# EAGLE design FEP (EAGLE 9.4.2)
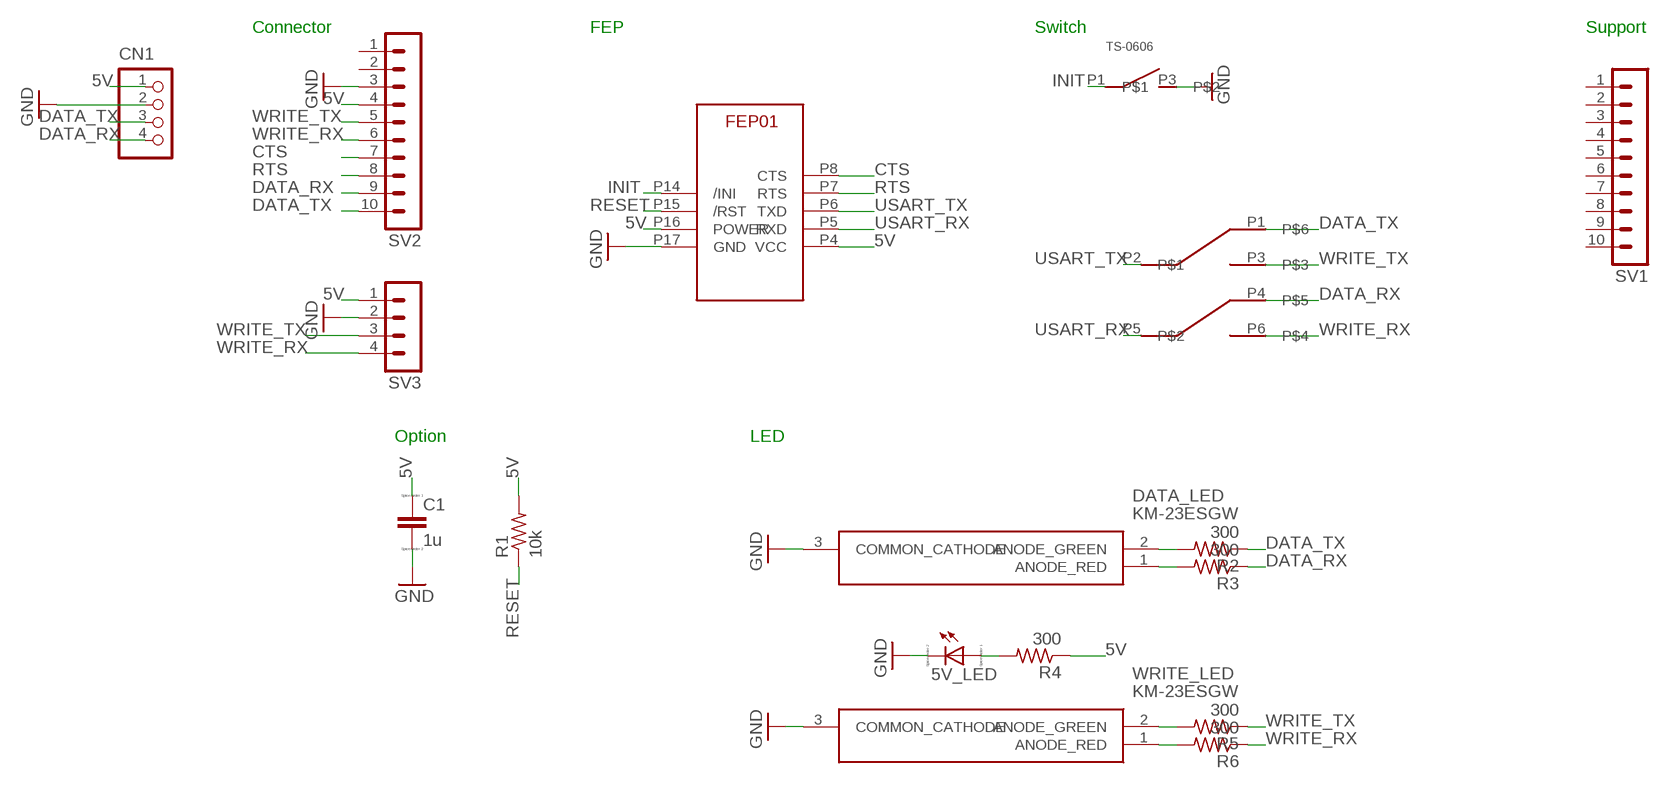
[diagram p0: schematic, sheet 1]

## Parts
5V_LED  LED_E  [LED_1206]
C1  1u  CC0603  [C0603]
CN1  S4B-XASK-1  [S4B-XASK-1]
DATA_LED  KM-23ESGW  [SOT-23]
FEP_1  FEP01  [FEP01]
R1  10k  R-US_R0603  [R0603]
R2  300  R-US_R0603  [R0603]
R3  300  R-US_R0603  [R0603]
R4  300  R-US_R0603  [R0603]
R5  300  R-US_R0603  [R0603]
R6  300  R-US_R0603  [R0603]
SV1  MA10-1  [MA10-1]
SV2  MA10-1  [MA10-1]
SV3  MA04-1  [MA04-1]
SW_1  P-03647_TS-0606  [TS-0606]
SW_3  P-08784_PS-70S  [PS-70S]
WRITE_LED  KM-23ESGW  [SOT-23]

## Nets
5V: C1.1 CN1.1 FEP_1.P4(VCC) FEP_1.P16(POWER) R1.2 R4.1 SV2.4 SV3.1
CTS: FEP_1.P8(CTS) SV2.7
DATA_RX: CN1.4 R3.1 SV2.9 SW_3.P4
DATA_TX: CN1.3 R2.1 SV2.10 SW_3.P1
GND: 5V_LED.C C1.2 CN1.2 DATA_LED.3(COMMON_CATHODE) FEP_1.P17(GND) SV2.3 SV3.2 SW_1.P3 WRITE_LED.3(COMMON_CATHODE)
INIT: FEP_1.P14(/INI) SW_1.P1
N$1: DATA_LED.1(ANODE_RED) R3.2
N$2: DATA_LED.2(ANODE_GREEN) R2.2
N$3: 5V_LED.A R4.2
N$4: R6.2 WRITE_LED.1(ANODE_RED)
N$5: R5.2 WRITE_LED.2(ANODE_GREEN)
RESET: FEP_1.P15(/RST) R1.1
RTS: FEP_1.P7(RTS) SV2.8
USART_RX: FEP_1.P5(RXD) SW_3.P5
USART_TX: FEP_1.P6(TXD) SW_3.P2
WRITE_RX: R6.1 SV2.6 SV3.4 SW_3.P6
WRITE_TX: R5.1 SV2.5 SV3.3 SW_3.P3
Unconnected: SV1.1 SV1.2 SV1.3 SV1.4 SV1.5 SV1.6 SV1.7 SV1.8 SV1.9 SV1.10 SV2.1 SV2.2

## Notes on the sheet
- Connector | FEP | Switch | Support
- Option | LED

## Library data of the parts
5V_LED = eagle-ltspice:LED_E: LED Source: http://www.osram.convergy.de Source: www.luxeon.com Source: www.kingbright.com; SPICEMODEL: NONE; SPICEPREFIX: D; SPICETYPE: diode
C1 = eagle-ltspice:C: CAPACITOR, European symbol; SPICEMODEL: NONE; SPICEPREFIX: C
CN1 = jst-xa:S4B-XASK-1: Wire-to-Board 2.5mm pitch top mount connector Source: http://www.jst-mfg.com/product/pdf/jpn/XA1.pdf http://www.jst-mfg.com/product/detail.php?series=272
DATA_LED WRITE_LED = SamacSys_Parts:KM-23ESGW: KINGBRIGHT - KM-23ESGW - LED, SMD, RED/GRN Source: Datasheet <http://www.farnell.com/datasheets/2047454.pdf>; DESCRIPTION: KINGBRIGHT - KM-23ESGW - LED, SMD, RED/GRN; HEIGHT: mm; MANUFACTURER_NAME: Kingbright; MANUFACTURER_PART_NUMBER: KM-23ESGW; MOUSER_PART_NUMBER: N/A; MOUSER_PRICE-STOCK: https://www.mouser.com/Search/Refine.aspx?Keyword=N%2FA
FEP_1 = Robot Creating Club:FEP01
R1-R6 = audio amplifier example:R-US_: RESISTOR, American symbol
SV1 SV2 = con-lstb:MA10-1: PIN HEADER; OC_FARNELL: unknown; OC_NEWARK: unknown
SV3 = con-lstb:MA04-1: PIN HEADER; OC_FARNELL: unknown; OC_NEWARK: unknown
SW_1 = Akizuki:P-03647_TS-0606
SW_3 = Akizuki:P-08784_PS-70S

## Board
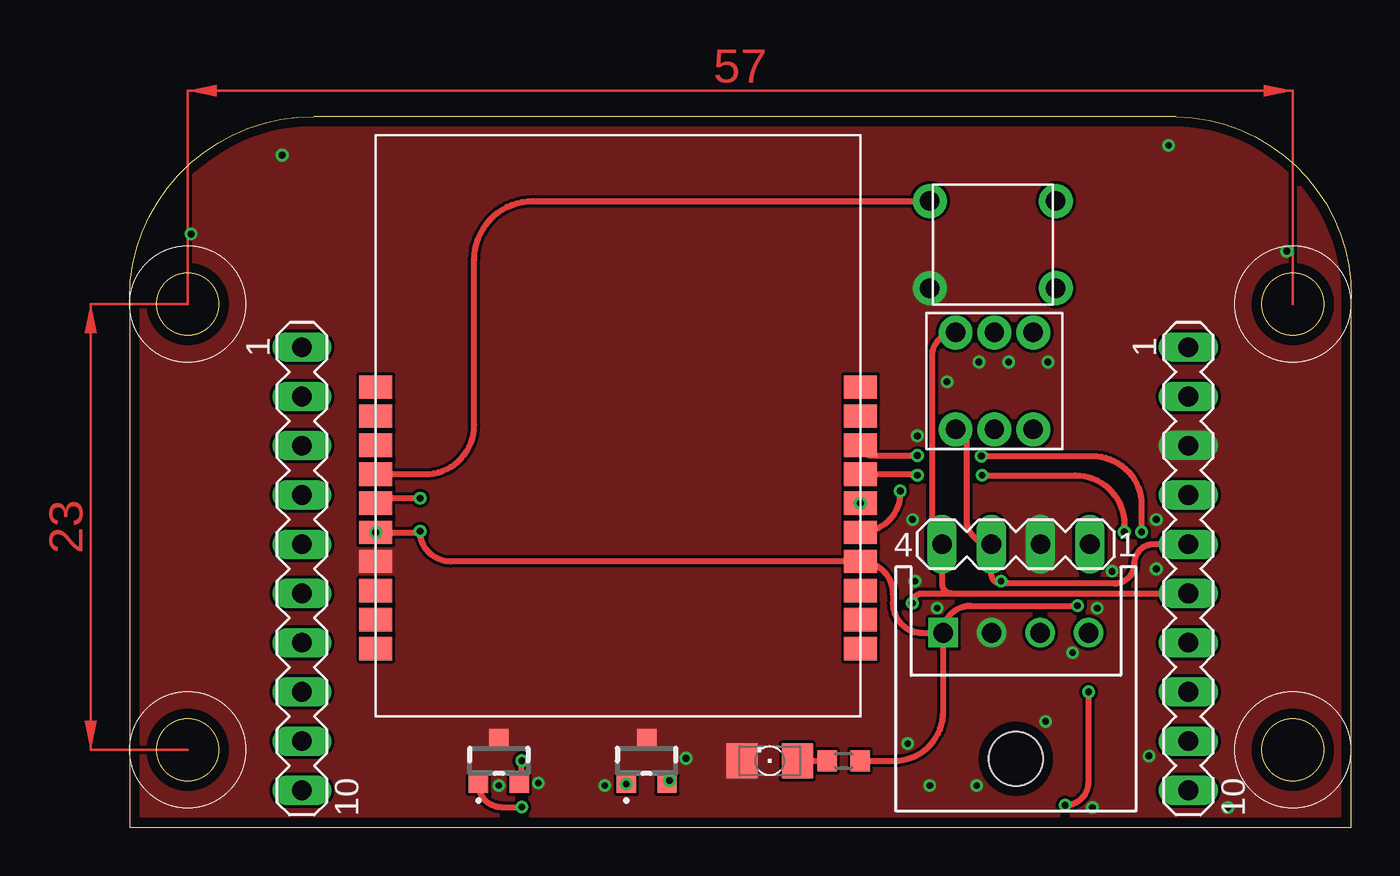
[diagram p1: board, top side]
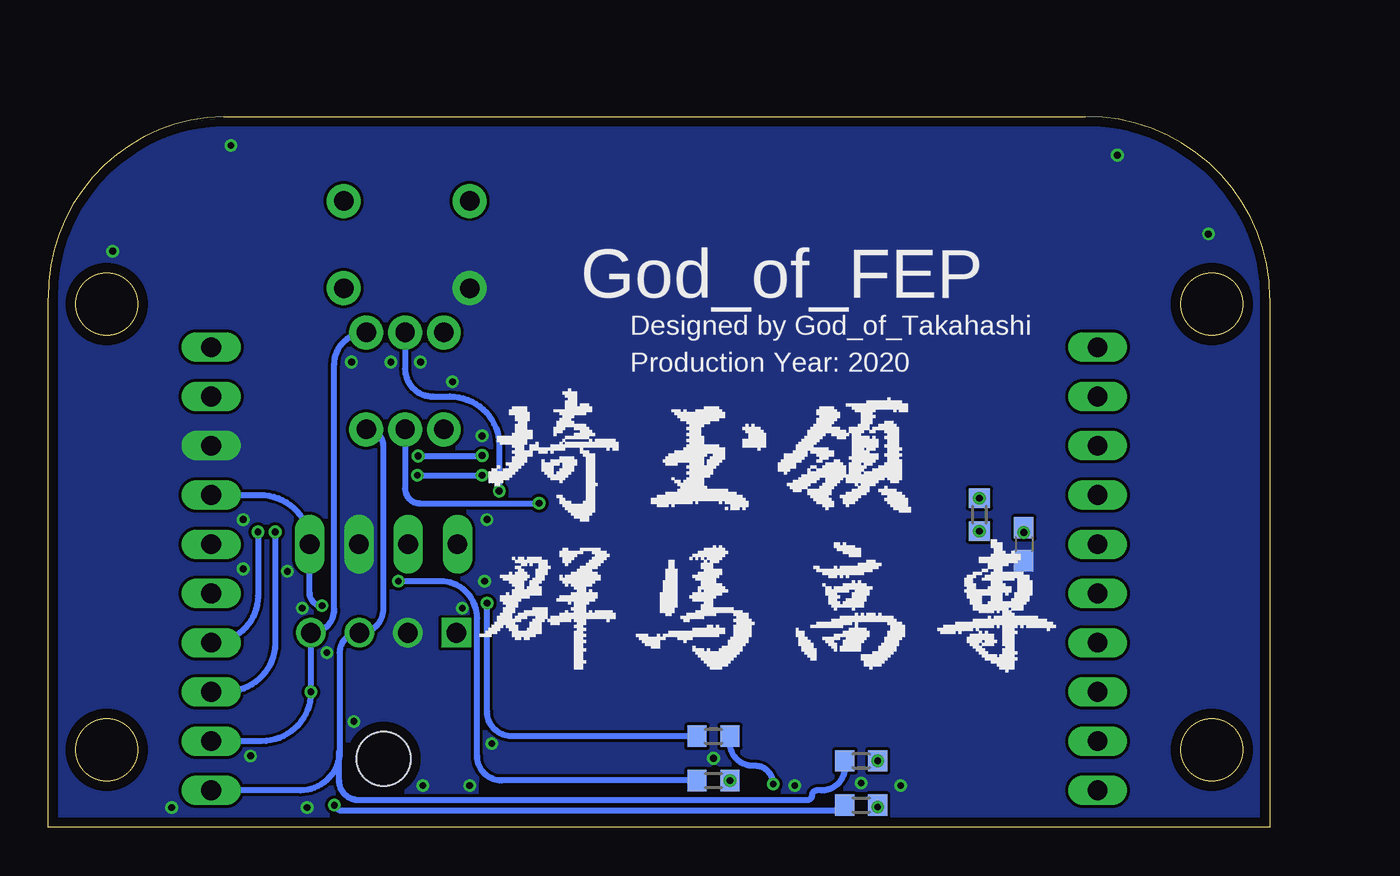
[diagram p2: board, bottom side, seen from below]

Size 63 x 36.66 mm. Coordinates in mm from the lower left corner, seen from the top.
Outline: 0,0 63,0 63,27.3 arc90 53.98,36.66 9.53,36.66 arc90 0,27.3 0,0
Outline: circle at 3,27 radius 1.6
Outline: circle at 3,4 radius 1.6
Outline: circle at 60,4 radius 1.6
Outline: circle at 60,27 radius 1.6
Copper layers (1*16): Top 0.035mm / dielectric 1.6mm / Bottom 0.035mm
Design rules "Elecrow_2-layer_PCB_eagle_rule": minimum track width 6mil, minimum drill 12mil, track to track 6mil, track to pad 6mil, pad to pad 6mil, via to via 8mil, smd to smd 0mil, copper to edge 20mil, drill to drill 10mil, minimum pad ring 6mil, minimum via ring 6mil, stop-mask expansion 0mil, vias tented up to drill 100mil, thermal gap 10mil
bRestrict: 3 lines

### Footprints (pad centres in the part's own frame; a part is rotated, then mirrored left to right if it is on the bottom)
LED_1206 = smd 1.6 x 1.803: A -1.422,0; C 1.422,0
C0603 = smd 1.1 x 1: 1 -0.85,0; 2 0.85,0
S4B-XASK-1 = drill 1.016 square: 1 3.75,0 | drill 1.016: 2 1.25,0; 3 -1.25,0; 4 -3.75,0 | hole 2.8: 0,6.5
SOT-23 = smd 1 x 0.9: 1 1.05,1.2; 2 -1.05,1.2; 3 0,-1.2
FEP01 = smd 1.7 x 1.2: P1 25,3.5; P2 25,5; P3 25,6.5; P4 25,8; P5 25,9.5; P6 25,11; P7 25,12.5; P8 25,14; P9 25,15.5; P10 25,17; P11 0,17; P12 0,15.5; P13 0,14; P14 0,12.5; P15 0,11; P16 0,9.5; P17 0,8; P18 0,6.5; P19 0,5; P20 0,3.5
R0603 = smd 1 x 1.1: 1 -0.85,0; 2 0.85,0
MA10-1 = drill 1.016 long: 1 -11.43,0; 2 -8.89,0; 3 -6.35,0; 4 -3.81,0; 5 -1.27,0; 6 1.27,0; 7 3.81,0; 8 6.35,0; 9 8.89,0; 10 11.43,0
MA04-1 = drill 1.016 long: 1 -3.81,0; 2 -1.27,0; 3 1.27,0; 4 3.81,0
TS-0606 = drill 1 pad 1.75: P1 0,4.5; P2 6.5,4.5; P3 0,0; P4 6.5,0
PS-70S = drill 1 pad 1.75: P1 0,5; P2 2,5; P3 4,5; P4 0,0; P5 2,0; P6 4,0

### Placement (x,y rotation side)
5V_LED  33.02,3.43 180 top
C1  12.7,14.61 270 bottom
CN1  45.72,10.03 180 top
DATA_LED  19.05,3.43 180 top
FEP_1  12.7,5.71 0 top
R1  14.99,16.13 270 bottom
R2  21.08,3.43 0 bottom
R3  21.08,1.14 0 bottom
R4  36.83,3.43 180 top
R5  28.7,2.41 0 bottom
R6  28.7,4.7 0 bottom
SV1  8.89,13.34 270 top
SV2  54.61,13.34 270 top
SV3  45.72,14.61 180 top
SW_1  41.27,27.81 0 top
SW_3  46.61,25.53 180 top
WRITE_LED  26.67,3.43 180 top

### Tracks (layer width: path | path; a pad name or v marks a point on that pad's centre or on a via)
5V  (via drill 0.35)
  Top 0.305: R4.1 39.43,3.43 arc90 41.97,5.97 CN1.1 | FEP_1.P16 14.92,15.21 arc90 R1.2 arc90 16.55,13.71 FEP_1.P4 arc-90 39.37,12.04 39.37,11.56 arc90 40.89,10.03 CN1.1 | CN1.1 arc-90 43.37,11.43 v48.89,11.43
  Bottom 0.305: C1.1 FEP_1.P16 | SV2.4 52.07,17.14 arc90 SV3.1 49.53,12.07 arc-90 v48.89,11.43
  other vias: 14.99,15.28 12.7,15.21
CTS  (via drill 0.35)
  Top 0.305: FEP_1.P8 arc90 38.24,19.18 v40.64,19.18 | v43.94,19.15 49.66,19.15 arc-90 52.2,16.61 v52.2,15.24
  Bottom 0.305: v43.94,19.15 40.66,19.15 arc90 v40.64,19.18 | v52.2,15.24 52.2,11.94 arc90 SV2.7
DATA_RX  (via drill 0.35)
  Top 0.305: v48.26,1.14 arc90 49.47,2.35 v49.47,6.99
  Bottom 0.305: SV2.9 52.01,4.45 arc-90 v49.47,6.99 CN1.4 arc-90 48.26,11.24 48.26,23.88 arc90 SW_3.P4 | v48.26,1.14 48.01,0.89 22.19,0.89 R3.1
DATA_TX
  Bottom 0.305: 47.99,3.94 47.99,9.02 arc90 CN1.3 arc-90 45.72,11.28 45.72,19.64 arc-90 SW_3.P1 | 47.99,3.94 arc90 50.02,1.91 SV2.10 | R2.1 21.93,3.09 arc90 23.11,1.91 23.37,1.91 arc-90 23.62,1.65 arc90 23.88,1.4 46.99,1.4 arc90 48.01,2.41 48.01,3.92 arc90 47.99,3.94
GND  (via drill 0.35)
  other vias: 3.17,30.61 7.87,34.67 53.59,35.18 59.69,29.72 45.34,24 47.37,24 40.64,20.19 52.58,3.68 49.66,1.02 56.64,1.02 43.69,2.16 47.24,5.46 41.66,11.3 41.27,2.16 40.39,15.88 40.51,12.7 40.13,4.32 28.7,3.56 21.08,2.29 24.51,2.16 43.81,24 19.05,2.16 49.91,11.3 48.64,9.02 50.67,13.21 52.96,13.34 52.96,15.88 42.16,22.99
  pour Bottom (no thermals): -4.92,40.01 -4.92,-0.64 68.42,-0.64 68.42,40.01
  pour Top (no thermals): -4.92,40.01 -4.92,-0.64 68.42,-0.64 68.42,40.01
INIT
  Top 0.305: FEP_1.P14 15.24,18.21 arc90 17.78,20.75 17.78,29.27 arc-90 20.83,32.31 SW_1.P1
N$1  (via drill 0.35)
  Top 0.305: DATA_LED.1 arc90 19.18,1.04 v20.23,1.04
  Bottom 0.305: v20.23,1.04 R3.2
N$2  (via drill 0.35)
  Top 0.305: DATA_LED.2 arc90 20.23,2.36 R2.2
  other vias: 20.23,3.43
N$3
  Top 0.305: 5V_LED.A R4.2
N$4  (via drill 0.35)
  Bottom 0.305: WRITE_LED.1 arc-90 26.57,3.17 26.67,3.17 arc90 27.85,4.36 R6.2
  other vias: 25.62,2.23
N$5  (via drill 0.35)
  Top 0.305: WRITE_LED.2 27.72,2.28 arc-90 R5.2
  other vias: 27.85,2.41
RESET  (via drill 0.35)
  Top 0.305: FEP_1.P15 arc-90 12.96,16.98 R1.1
  other vias: 14.99,16.98
RTS  (via drill 0.35)
  Top 0.305: FEP_1.P7 40.59,18.21 arc-90 v40.64,18.16 | v43.98,18.16 48.77,18.16 arc-90 51.31,15.62 v51.31,15.24
  Bottom 0.305: v43.98,18.16 v40.64,18.16 | v51.31,15.24 51.31,9.53 arc90 53.85,6.99 SV2.8
USART_RX  (via drill 0.35)
  Top 0.305: v39.75,17.35 39.75,17.27 arc-90 FEP_1.P5
  Bottom 0.305: SW_3.P5 44.61,23.65 arc-90 43.18,22.23 42.29,22.23 arc90 39.75,19.68 v39.75,17.35
USART_TX  (via drill 0.35)
  Bottom 0.305: SW_3.P2 44.61,17.48 arc-90 43.85,16.71 FEP_1.P6
  other vias: 37.7,16.71
WRITE_RX  (via drill 0.35)
  Top 0.305: SW_3.P6 arc90 41.4,24.32 41.4,15.11 arc90 SV3.4 41.91,12.57 arc90 42.42,12.06 | 42.42,12.06 SV2.6 | v40.38,11.56 arc-90 40.88,12.06 42.42,12.06
  Bottom 0.305: R6.1 39.11,4.7 arc90 40.38,5.97 v40.38,11.56
WRITE_TX  (via drill 0.35)
  Top 0.305: SV2.5 52.83,14.61 arc90 51.82,13.59 arc-90 50.8,12.57 44.96,12.57 | 44.96,12.57 arc-90 44.45,13.08 SV3.3 arc-90 43.18,15.88 43.18,19.96 arc90 SW_3.P3 | v44.96,12.7 44.96,12.57
  Bottom 0.305: R5.1 39.62,2.41 | 39.62,2.41 arc90 40.89,3.68 | 40.89,3.68 40.89,10.79 arc-90 42.8,12.7 v44.96,12.7 | 39.62,2.41 arc90 40.89,3.68
(copper drawn outside any net)
  shapes: Top area x2

### Text on the board
bPlace: God_of_FEP | Designed by God_of_Takahashi | Production Year: 2020